# Altium schematic sheet LiFi_transmitter.SchDoc
size A4
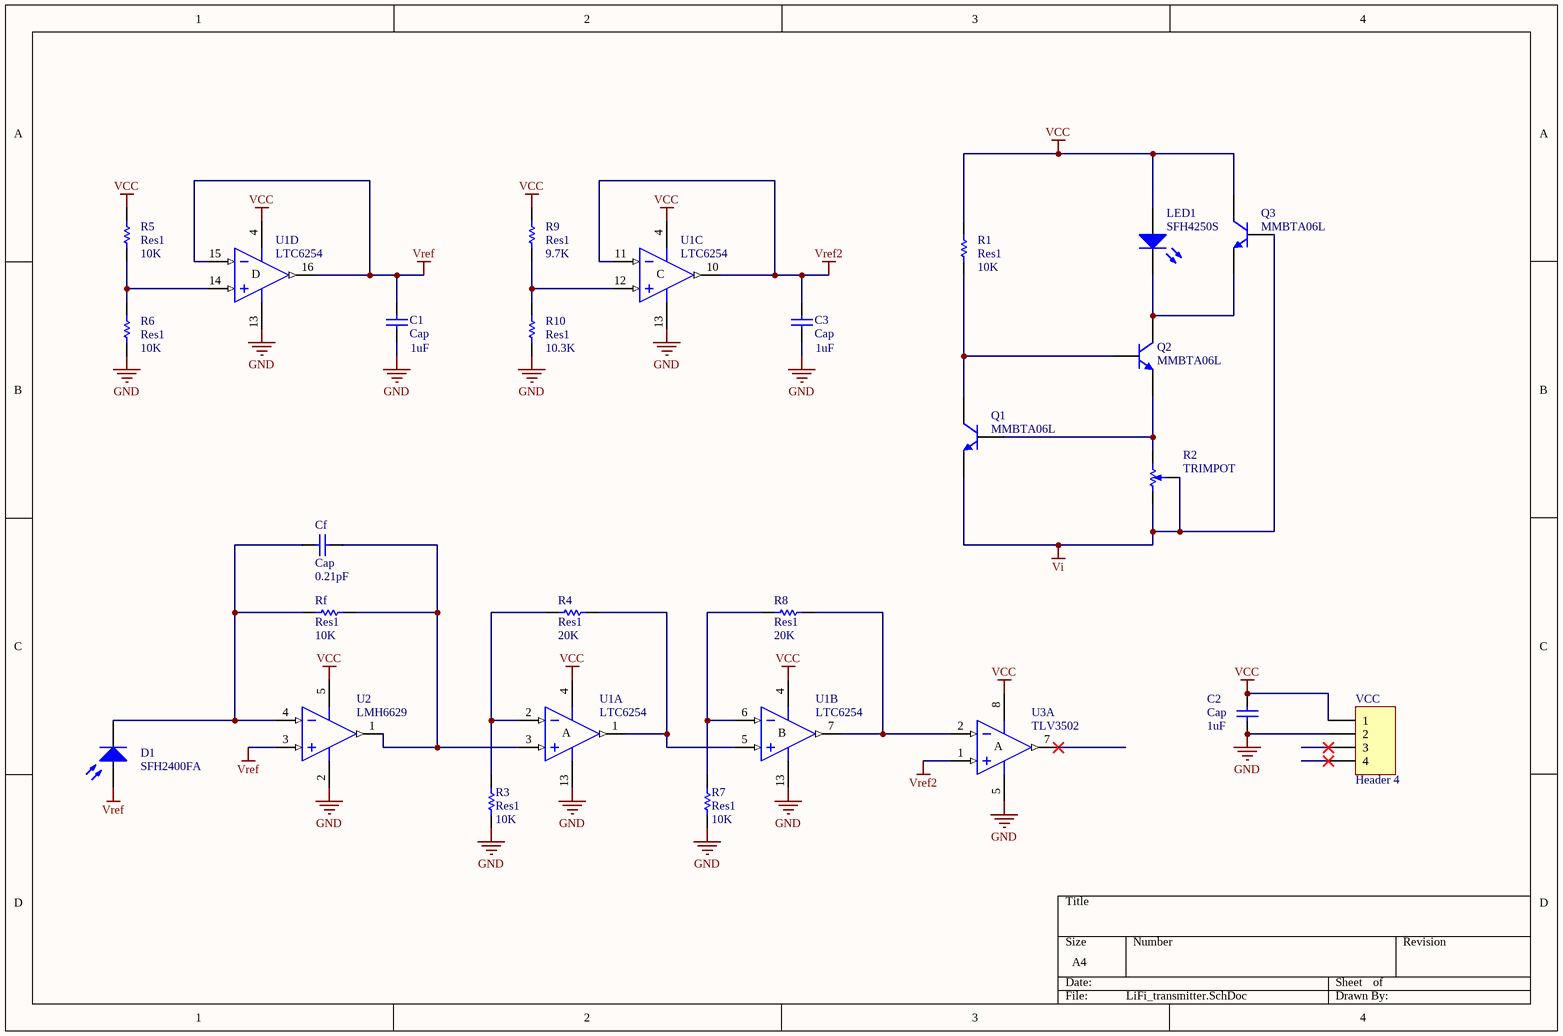
[diagram p0: LiFi_transmitter.SchDoc]

## Parts
C1  Cap  value 1uF  [1608[0603]]
C2  Cap  value 1uF  [1608[0603]]
C3  Cap  value 1uF  [1608[0603]]
Cf  Cap  value 0.21pF  [1608[0603]]
D1  SFH2400FA  [SFH2400FA]
LED1  SFH4250S  [SFH4250S]
Q1  MMBTA06L  [MMBTA06L]
Q2  MMBTA06L  [MMBTA06L]
Q3  MMBTA06L  [MMBTA06L]
R1  Res1  value 10K  [1608[0603]]
R2  TRIMPOT  [TC33]
R3  Res1  value 10K  [1608[0603]]
R4  Res1  value 20K  [1608[0603]]
R5  Res1  value 10K  [1608[0603]]
R6  Res1  value 10K  [1608[0603]]
R7  Res1  value 10K  [1608[0603]]
R8  Res1  value 20K  [1608[0603]]
R9  Res1  value 9.7K  [1608[0603]]
R10  Res1  value 10.3K  [1608[0603]]
Rf  Res1  value 10K  [1608[0603]]
U1  LTC6254  [LTC6254]  (parts A,B,C,D of 4)
U2  LMH6629  [LMV793]
U3  TLV3502  [TLV3502]  (part A of 2)
VCC  Header 4  [HDR1X4]

## Nets
GND: C1.1 C2.1 C3.1 R3.1 R6.1 R7.1 R10.1 U1.13(V-) U2.2(V-) U3.5(V-) VCC.2
VCC: C2.2 LED1.2,_3,_4(A) Q3.3(C) R1.2 R5.2 R9.2 U1.4(V+) U2.5(V+) U3.8(V+) VCC.1
Vi: Q1.2(E) Q3.1(B) R2.2(W) R2.3(-)
Vref: C1.2 D1.3(A) U1.15(IN-) U1.16(OUT) U2.3(IN+)
Vref2: C3.2 U1.10(OUT) U1.11(IN-) U3.1(IN+)
NetCf_1: Cf.1 D1.1(K) Rf.1 U2.4(IN-)
NetCf_2: Cf.2 Rf.2 U1.3(IN+) U2.1(OUT)
NetLED1_1: LED1.1(K) Q2.3(C) Q3.2(E)
NetQ1_1: Q1.1(B) Q2.2(E) R2.1(+)
NetQ1_3: Q1.3(C) Q2.1(B) R1.1
NetR3_2: R3.2 R4.2 U1.2(IN-)
NetR4_1: R4.1 U1.1(OUT) U1.5(IN+)
NetR5_1: R5.1 R6.2 U1.14(IN+)
NetR7_2: R7.2 R8.2 U1.6(IN-)
NetR8_1: R8.1 U1.7(OUT) U3.2(IN-)
NetR9_1: R9.1 R10.2 U1.12(IN+)

Not connected (* = marked no-connect by the designer): U3 7(OUT)*; VCC 3* 4*

## Notes on the sheet
- (in symbol LTC6254, part A) A
- (in symbol LTC6254, part B) B
- (in symbol LTC6254, part C) C
- (in symbol LTC6254, part D) D
- (in symbol TLV3502, part A) A

## Library data of the parts
C1-C3 Cf = Cap: Capacitor; Published: 8-Jun-2000; LatestRevisionDate: 17-Jul-2002; LatestRevisionNote: Re-released for DXP Platform.; PackageReference: RAD-0.3; Publisher: Altium Limited; PackageDescription: Radial Cap, Thru-Hole; 2 Leads; 0.3 in Pin Spacing
D1 = SFH2400FA: Photodiode 900nm 5ns 120° 3-SMD, Gull Wing
LED1 = SFH4250S: Infrared (IR) Emitter 860nm 3.1V 100mA 30mW/sr @ 100mA 120° 4-PLCC
Q1-Q3 = MMBTA06L: Bipolar (BJT) Transistor NPN 80V 500mA 100MHz 225mW Surface Mount SOT-23-3 (TO-236)
R1 R3-R10 Rf = Res1: Resistor; Published: 8-Jun-2000; LatestRevisionDate: 17-Jul-2002; LatestRevisionNote: Re-released for DXP Platform.; PackageReference: AXIAL-0.3; Publisher: Altium Limited; PackageDescription: Axial Device, Thru-Hole; 2 Leads; 0.3 in Pin Spacing
R2 = TC33: TRIMMER 100 OHM TO 1 MOHM 0.1W SMD
U1 = LTC6254: IC OPAMP GP 720MHZ RRO 16MSOP
U2 = LMH6629: IC OPAMP VFB 1GHZ SOT23-5
U3 = TLV3502: 4.5-ns Rail-to-Rail High-Speed Comparator; Published: 16-Jan-2001; LatestRevisionDate: 04-Mar-2005; LatestRevisionNote: Stylized 3D Model Added.; DatasheetVersion: Aug-1994; PackageVersion: Jun-1999; PackageReference: P008; Publisher: Altium Limited; PackageDescription: DIP; 8 Leads; Row Spacing 7.62 mm; Pitch 2.54 mm; Code_JEDEC: MO-001-AN; ComponentLink1Description: Manufacturer Link; ComponentLink1URL: http://www.ti.com/; ComponentLink2Description: Datasheet; ComponentLink2URL: http://www-s.ti.com/sc/ds/lf353.pdf
VCC = Header 4: Header, 4-Pin; LatestRevisionDate: 17-Jul-2002; LatestRevisionNote: Re-released for DXP Platform.; Publisher: Altium Limited